# Altium schematic sheet Robot-Main.schdoc
size A2
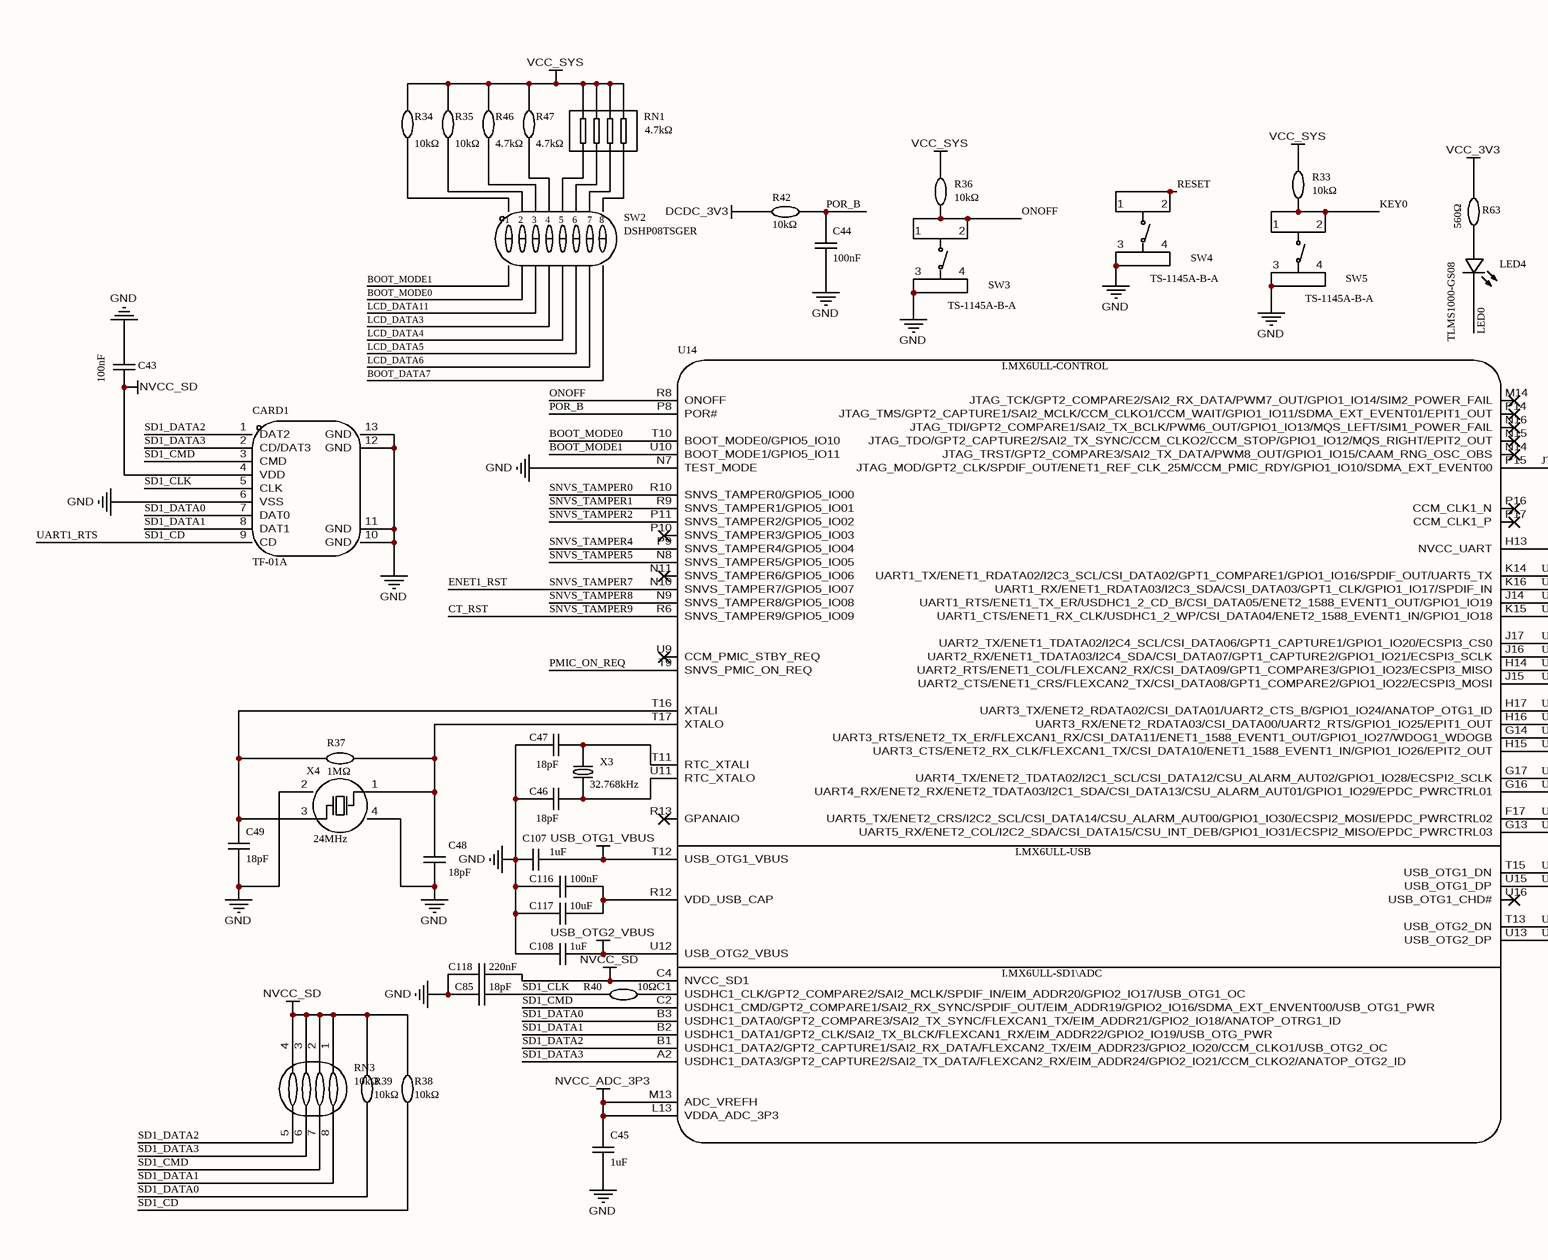
[diagram p0: Robot-Main.schdoc, left]
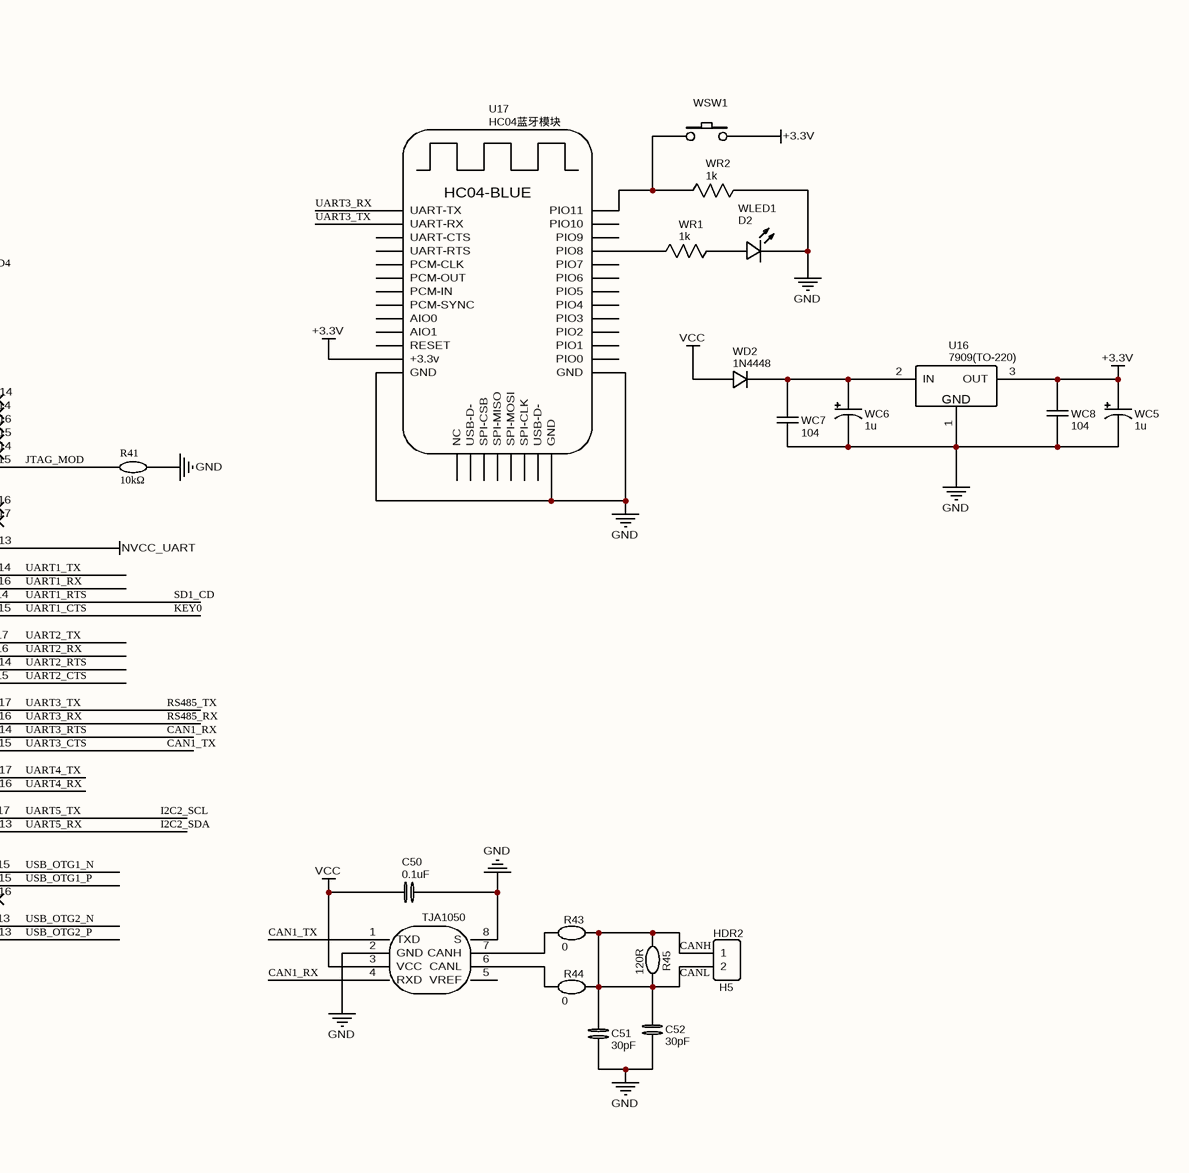
[diagram p1: Robot-Main.schdoc, right]

## Parts
C43  100nF  [0]  (value not drawn)
C44  100nF  [0]  (value not drawn)
C45  1uF  [0]  (value not drawn)
C46  18pF  [0]  (value not drawn)
C47  18pF  [0]  (value not drawn)
C48  18pF  [0]  (value not drawn)
C49  18pF  [0]  (value not drawn)
C50  0.1uF  [C0603]
C51  30pF  [C0603]
C52  30pF  [C0603]
C85  18pF  [0]  (value not drawn)
C107  1uF  [0]  (value not drawn)
C108  1uF  [0]  (value not drawn)
C116  100nF  [0]  (value not drawn)
C117  10uF  [0]  (value not drawn)
C118  220nF  [0]  (value not drawn)
CARD1  TF-01A  [0]  (value not drawn)
H5  HDR2  [HDR-F-2.54_1X2]
LED4  TLMS1000-GS08  [0]  (value not drawn)
R33  10kΩ  [0]  (value not drawn)
R34  10kΩ  [0]  (value not drawn)
R35  10kΩ  [0]  (value not drawn)
R36  10kΩ  [0]  (value not drawn)
R37  1MΩ  [0]  (value not drawn)
R38  10kΩ  [0]  (value not drawn)
R39  10kΩ  [0]  (value not drawn)
R40  10Ω  [0]  (value not drawn)
R41  10kΩ  [0]  (value not drawn)
R42  10kΩ  [0]  (value not drawn)
R43  0  [R0603]
R44  0  [R0603]
R45  120R  [R0603]
R46  4.7kΩ  [0]  (value not drawn)
R47  4.7kΩ  [0]  (value not drawn)
R63  560Ω  [0]  (value not drawn)
RN1  4.7kΩ  [0]  (value not drawn)
RN3  10kΩ  [0]  (value not drawn)
SW2  DSHP08TSGER  [0]  (value not drawn)
SW3  TS-1145A-B-A  [0]  (value not drawn)
SW4  TS-1145A-B-A  [0]  (value not drawn)
SW5  TS-1145A-B-A  [0]  (value not drawn)
U14  MCIMX6Y2CVM08AB  [0]  (value not drawn)
U15  TJA1050  [SOIC-8_L5.0-W4.0-P1.27-LS6.0-BL]
U16  7909(TO-220)  [TO-220IS_L10.16-W4.7-P2.54-L]
U17  HC04蓝牙模块
WC5  1u  [CAP-D3.0XF1.5]
WC6  1u  [CAP-D3.0XF1.5]
WC7  104  [RAD-0.1]
WC8  104  [RAD-0.1]
WD2  1N4448  [DO-35]
WLED1  D2  [LED-3MM/2.54]
WR1  1k  [AXIAL-0.3]
WR2  1k  [AXIAL-0.3]
WSW1  EVQ22705R  [KEY-6.0*6.0-4]  (value not drawn)
X3  32.768kHz  [0]  (value not drawn)
X4  24MHz  [0]  (value not drawn)

## Nets
+3.3V: U16.3(OUT) U17.15(+3.3v) WC5.1 WC8.2 WSW1.2
DCDC_3V3: R42.2
GND: C43.1 C44.2 C45.1 C46.2 C47.2 C48.1 C49.1 C50.2 C51.1 C52.1 C85.2 C107.2 C108.2 C116.1 C117.2 C118.2 CARD1.6(VSS) CARD1.10(GND) CARD1.11(GND) CARD1.12(GND) CARD1.13(GND) R41.1 SW3.3 SW3.4 SW4.3 SW4.4 SW5.3 SW5.4 U14.N7(TEST_MODE) U15.2(GND) U15.8(S) U16.1(GND) U17.14(GND) U17.28(GND) U17.36(GND) WC5.2 WC6.2 WC7.1 WC8.1 WLED1.2(K) WR2.2 X4.2(GND) X4.4(GND)
NVCC_ADC_3P3: C45.2 U14.L13(VDDA_ADC_3P3) U14.M13(ADC_VREFH)
NVCC_SD: C43.2 C118.1 CARD1.4(VDD) R38.2 R39.2 RN3.1 RN3.2 RN3.3 RN3.4 U14.C4(NVCC_SD1)
NVCC_UART: U14.H13(NVCC_UART)
USB_OTG1_VBUS: C107.1 U14.T12(USB_OTG1_VBUS)
USB_OTG2_VBUS: C108.1 U14.U12(USB_OTG2_VBUS)
VCC: C50.1 U15.3(VCC) WD2.1(A)
VCC_3V3: R63.1
VCC_SYS: R33.1 R34.2 R35.2 R36.1 R46.2 R47.2 RN1.1 RN1.2 RN1.3 RN1.4
BOOT_DATA7: SW2.16
BOOT_MODE0: SW2.10(PIN10) U14.T10(BOOT_MODE0/GPIO5_IO10)
BOOT_MODE1: SW2.9(PIN9) U14.U10(BOOT_MODE1/GPIO5_IO11)
CAN1_RX: U14.G14(UART3_RTS/ENET2_TX_ER/FLEXCAN1_RX/CSI_DATA11/ENET1_1588_EVENT1_OUT/GPIO1_IO27/WDOG1_WDOGB) U15.4(RXD)  [also labelled UART3_RTS]
CAN1_TX: U14.H15(UART3_CTS/ENET2_RX_CLK/FLEXCAN1_TX/CSI_DATA10/ENET1_1588_EVENT1_IN/GPIO1_IO26/EPIT2_OUT) U15.1(TXD)  [also labelled UART3_CTS]
CANH: C51.2 C52.2 H5.1 H5.2 R43.2 R44.2 R45.1 R45.2  [also labelled CANL]
CT_RST: U14.R6(SNVS_TAMPER9/GPIO5_IO09)  [also labelled SNVS_TAMPER9]
ENET1_RST: U14.N10(SNVS_TAMPER7/GPIO5_IO07)  [also labelled SNVS_TAMPER7]
I2C2_SCL: U14.F17(UART5_TX/ENET2_CRS/I2C2_SCL/CSI_DATA14/CSU_ALARM_AUT00/GPIO1_IO30/ECSPI2_MOSI/EPDC_PWRCTRL02)  [also labelled UART5_TX]
I2C2_SDA: U14.G13(UART5_RX/ENET2_COL/I2C2_SDA/CSI_DATA15/CSU_INT_DEB/GPIO1_IO31/ECSPI2_MISO/EPDC_PWRCTRL03)  [also labelled UART5_RX]
JTAG_MOD: R41.2 U14.P15(JTAG_MOD/GPT2_CLK/SPDIF_OUT/ENET1_REF_CLK_25M/CCM_PMIC_RDY/GPIO1_IO10/SDMA_EXT_EVENT00)
KEY0: R33.2 SW5.1 SW5.2 U14.K15(UART1_CTS/ENET1_RX_CLK/USDHC1_2_WP/CSI_DATA04/ENET2_1588_EVENT1_IN/GPIO1_IO18)  [also labelled UART1_CTS]
LCD_DATA3: SW2.12(PIN12)
LCD_DATA4: SW2.13(PIN13)
LCD_DATA5: SW2.14(PIN14)
LCD_DATA6: SW2.15
LCD_DATA11: SW2.11(PIN11)
LED0: LED4.2(K)
ONOFF: R36.2 SW3.1 SW3.2 U14.R8(ONOFF)
PMIC_ON_REQ: U14.T9(SNVS_PMIC_ON_REQ)
POR_B: C44.1 R42.1 U14.P8(POR#)
RESET: SW4.1 SW4.2
RS485_RX: U14.H16(UART3_RX/ENET2_RDATA03/CSI_DATA00/UART2_RTS/GPIO1_IO25/EPIT1_OUT) U17.27(UART-TX)  [also labelled UART3_RX]
RS485_TX: U14.H17(UART3_TX/ENET2_RDATA02/CSI_DATA01/UART2_CTS_B/GPIO1_IO24/ANATOP_OTG1_ID) U17.26(UART-RX)  [also labelled UART3_TX]
SD1_CD: CARD1.9(CD) R38.1 U14.J14(UART1_RTS/ENET1_TX_ER/USDHC1_2_CD_B/CSI_DATA05/ENET2_1588_EVENT1_OUT/GPIO1_IO19)  [also labelled UART1_RTS]
SD1_CLK: C85.1 CARD1.5(CLK) R40.1
SD1_CMD: CARD1.3(CMD) RN3.7 U14.C2(USDHC1_CMD/GPT2_COMPARE1/SAI2_RX_SYNC/SPDIF_OUT/EIM_ADDR19/GPIO2_IO16/SDMA_EXT_ENVENT00/USB_OTG1_PWR)
SD1_DATA0: CARD1.7(DAT0) R39.1 U14.B3(USDHC1_DATA0/GPT2_COMPARE3/SAI2_TX_SYNC/FLEXCAN1_TX/EIM_ADDR21/GPIO2_IO18/ANATOP_OTRG1_ID)
SD1_DATA1: CARD1.8(DAT1) RN3.8 U14.B2(USDHC1_DATA1/GPT2_CLK/SAI2_TX_BLCK/FLEXCAN1_RX/EIM_ADDR22/GPIO2_IO19/USB_OTG_PWR)
SD1_DATA2: CARD1.1(DAT2) RN3.5 U14.B1(USDHC1_DATA2/GPT2_CAPTURE1/SAI2_RX_DATA/FLEXCAN2_TX/EIM_ADDR23/GPIO2_IO20/CCM_CLKO1/USB_OTG2_OC)
SD1_DATA3: CARD1.2(CD/DAT3) RN3.6 U14.A2(USDHC1_DATA3/GPT2_CAPTURE2/SAI2_TX_DATA/FLEXCAN2_RX/EIM_ADDR24/GPIO2_IO21/CCM_CLKO2/ANATOP_OTG2_ID)
SNVS_TAMPER0: U14.R10(SNVS_TAMPER0/GPIO5_IO00)
SNVS_TAMPER1: U14.R9(SNVS_TAMPER1/GPIO5_IO01)
SNVS_TAMPER2: U14.P11(SNVS_TAMPER2/GPIO5_IO02)
SNVS_TAMPER4: U14.P9(SNVS_TAMPER4/GPIO5_IO04)
SNVS_TAMPER5: U14.N8(SNVS_TAMPER5/GPIO5_IO05)
SNVS_TAMPER8: U14.N9(SNVS_TAMPER8/GPIO5_IO08)
UART1_RX: U14.K16(UART1_RX/ENET1_RDATA03/I2C3_SDA/CSI_DATA03/GPT1_CLK/GPIO1_IO17/SPDIF_IN)
UART1_TX: U14.K14(UART1_TX/ENET1_RDATA02/I2C3_SCL/CSI_DATA02/GPT1_COMPARE1/GPIO1_IO16/SPDIF_OUT/UART5_TX)
UART2_CTS: U14.J15(UART2_CTS/ENET1_CRS/FLEXCAN2_TX/CSI_DATA08/GPT1_COMPARE2/GPIO1_IO22/ECSPI3_MOSI)
UART2_RTS: U14.H14(UART2_RTS/ENET1_COL/FLEXCAN2_RX/CSI_DATA09/GPT1_COMPARE3/GPIO1_IO23/ECSPI3_MISO)
UART2_RX: U14.J16(UART2_RX/ENET1_TDATA03/I2C4_SDA/CSI_DATA07/GPT1_CAPTURE2/GPIO1_IO21/ECSPI3_SCLK)
UART2_TX: U14.J17(UART2_TX/ENET1_TDATA02/I2C4_SCL/CSI_DATA06/GPT1_CAPTURE1/GPIO1_IO20/ECSPI3_CS0)
UART4_RX: U14.G16(UART4_RX/ENET2_RX/ENET2_TDATA03/I2C1_SDA/CSI_DATA13/CSU_ALARM_AUT01/GPIO1_IO29/EPDC_PWRCTRL01)
UART4_TX: U14.G17(UART4_TX/ENET2_TDATA02/I2C1_SCL/CSI_DATA12/CSU_ALARM_AUT02/GPIO1_IO28/ECSPI2_SCLK)
USB_OTG1_N: U14.T15(USB_OTG1_DN)
USB_OTG1_P: U14.U15(USB_OTG1_DP)
USB_OTG2_N: U14.T13(USB_OTG2_DN)
USB_OTG2_P: U14.U13(USB_OTG2_DP)
NetC46_1: C46.1 U14.U11(RTC_XTALO) X3.1
NetC47_1: C47.1 U14.T11(RTC_XTALI) X3.2
NetC48_2: C48.2 R37.2 U14.T17(XTALO) X4.1(OSC1)
NetC49_2: C49.2 R37.1 U14.T16(XTALI) X4.3(OSC2)
NetC116_2: C116.2 C117.1 U14.R12(VDD_USB_CAP)
NetLED4_1: LED4.1(A) R63.2
NetR34_1: R34.1 SW2.1(PIN1)
NetR35_1: R35.1 SW2.2(PIN2)
NetR40_2: R40.2 U14.C1(USDHC1_CLK/GPT2_COMPARE2/SAI2_MCLK/SPDIF_IN/EIM_ADDR20/GPIO2_IO17/USB_OTG1_OC)
NetR43_1: R43.1 U15.7(CANH)
NetR44_1: R44.1 U15.6(CANL)
NetR46_1: R46.1 SW2.3(PIN3)
NetR47_1: R47.1 SW2.4(PIN4)
NetRN1_5: RN1.5 SW2.5(PIN5)
NetRN1_6: RN1.6 SW2.6(PIN6)
NetRN1_7: RN1.7 SW2.7(PIN7)
NetRN1_8: RN1.8 SW2.8(PIN8)
NetU16_2: U16.2(IN) WC6.1 WC7.2 WD2.2(K)
NetU17_10: U17.10(PIO8) WR1.1
NetU17_13: U17.13(PIO11) WR2.1 WSW1.1
NetWLED1_1: WLED1.1(A) WR1.2

Not connected (* = marked no-connect by the designer): U14 M14(JTAG_TCK/GPT2_COMPARE2/SAI2_RX_DATA/PWM7_OUT/GPIO1_IO14/SIM2_POWER_FAIL)* N11(SNVS_TAMPER6/GPIO5_IO06)* N14(JTAG_TRST/GPT2_COMPARE3/SAI2_TX_DATA/PWM8_OUT/GPIO1_IO15/CAAM_RNG_OSC_OBS)* N15(JTAG_TDO/GPT2_CAPTURE2/SAI2_TX_SYNC/CCM_CLKO2/CCM_STOP/GPIO1_IO12/MQS_RIGHT/EPIT2_OUT)* N16(JTAG_TDI/GPT2_COMPARE1/SAI2_TX_BCLK/PWM6_OUT/GPIO1_IO13/MQS_LEFT/SIM1_POWER_FAIL)* P10(SNVS_TAMPER3/GPIO5_IO03)* P14(JTAG_TMS/GPT2_CAPTURE1/SAI2_MCLK/CCM_CLKO1/CCM_WAIT/GPIO1_IO11/SDMA_EXT_EVENT01/EPIT1_OUT)* P16(CCM_CLK1_N)* P17(CCM_CLK1_P)* R13(GPANAIO)* U9(CCM_PMIC_STBY_REQ)* U16(USB_OTG1_CHD#)*; U15 5(VREF); U17 2(PIO0) 3(PIO1) 4(PIO2) 5(PIO3) 6(PIO4) 7(PIO5) 8(PIO6) 9(PIO7) 11(PIO9) 12(PIO10) 16(RESET) 17(AIO0) 18(AIO1) 19(PCM-SYNC) 20(PCM-IN) 21(PCM-OUT) 22(PCM-CLK) 24(UART-RTS) 25(UART-CTS) 29(USB-D-) 30(SPI-CLK) 31(SPI-MOSI) 32(SPI-MISO) 33(SPI-CSB) 34(USB-D-) 35(NC)

## Notes on the sheet
- (in symbol HC04蓝牙模块) HC04-BLUE
- (in symbol MCIMX6Y2CVM08AB) I.MX6ULL-CONTROL; I.MX6ULL-USB; I.MX6ULL-SD1\ADC

## Library data of the parts
C43 C44 C116 = 100nF: Manufacturer: FH(风华); Symbol: 0402B104K160NT; Add into BOM: yes; Tolerance: ±10%; Voltage Rated: 16V; Temperature Coefficient: X7R; Name: 100nF; Device: 0402B104K160NT; LCSC Part Name: 100nF ±10% 16V; Supplier Part: C41851; Manufacturer Part: 0402B104K160NT; Supplier Footprint: 0402; JLCPCB Part Class: 扩展库; Datasheet: https://atta.szlcsc.com/upload/public/pdf/source/20170923/C41851_1506149456453988767.pdf; Supplier: LCSC; Convert to PCB: yes
C45 C107 C108 = 1uF: Manufacturer: SAMSUNG(三星); Symbol: CL05A105KP5NNNC; Add into BOM: yes; Tolerance: ±10%; Voltage Rated: 10V; Temperature Coefficient: X5R; Name: 1uF; Device: CL05A105KP5NNNC; LCSC Part Name: 1uF ±10% 10V; Supplier Part: C14445; Manufacturer Part: CL05A105KP5NNNC; Supplier Footprint: 0402; JLCPCB Part Class: 扩展库; Datasheet: https://atta.szlcsc.com/upload/public/pdf/source/20160103/1457707670698.pdf; Supplier: LCSC; Convert to PCB: yes
C46-C49 C85 = 18pF: Manufacturer: muRata(村田); Symbol: GRM1555C1H180JA01D; Add into BOM: yes; Tolerance: ±5%; Voltage Rated: 50V; Temperature Coefficient: C0G; Name: 18pF; Device: GRM1555C1H180JA01D; LCSC Part Name: 18pF ±5% 50V; Supplier Part: C33149; Manufacturer Part: GRM1555C1H180JA01D; Supplier Footprint: 0402; JLCPCB Part Class: 扩展库; Datasheet: https://atta.szlcsc.com/upload/public/pdf/source/20161108/1478586362936.pdf; Supplier: LCSC; Convert to PCB: yes
C50 = 0.1uF: nameAlias: Value(F); Contributor: LCEDA_Lib; spicePre: C; spiceSymbolName: C_0603_EU
C51 C52 = 30pF: nameAlias: Value(F); Contributor: LCEDA_Lib; spicePre: C; spiceSymbolName: C_0603_EU
C117 = 10uF: Manufacturer: TAIYO YUDEN(太诱); Symbol: JMK107BC6106MA-T; Add into BOM: yes; Tolerance: ±20%; Name: 10uF; Device: JMK107BC6106MA-T; LCSC Part Name: 10uF ±20%; Supplier Part: C669868; Manufacturer Part: JMK107BC6106MA-T; Supplier Footprint: 0603; JLCPCB Part Class: 扩展库; Datasheet: https://atta.szlcsc.com/upload/public/pdf/source/20200708/C669868_7EB6EA763537011BBD5B3495B56B624F.pdf; Supplier: LCSC; Convert to PCB: yes; Voltage Rated: -; Temperature Coefficient: -
C118 = 220nF: Manufacturer: SAMSUNG(三星); Symbol: CL05B224KO5NNNC; Add into BOM: yes; Tolerance: ±10%; Voltage Rated: 16V; Temperature Coefficient: X7R; Name: 220nF; Device: CL05B224KO5NNNC; LCSC Part Name: 220nF ±10% 16V; Supplier Part: C16772; Manufacturer Part: CL05B224KO5NNNC; Supplier Footprint: 0402; JLCPCB Part Class: 基础库; Datasheet: https://atta.szlcsc.com/upload/public/pdf/source/20160103/1457707689724.pdf; Supplier: LCSC; Convert to PCB: yes
CARD1 = TF-01A: Manufacturer: Yuandi(元迪); Symbol: TF-01A_C2889258; Add into BOM: yes; Card Type: MicroSD卡(TF卡); Connector Type: 卡座; Card Connection Mode: 自弹式; Maximum Body Height: 2mm; Name: TF-01A; Device: TF-01A_C2889258; LCSC Part Name: TF卡座自弹式9P外焊卡座; Supplier Part: C2889258; Manufacturer Part: TF-01A; Supplier Footprint: SMD; JLCPCB Part Class: 扩展库; Datasheet: https://atta.szlcsc.com/upload/public/pdf/source/20210830/44259D2B93BF4B637A446EF1520C4989.pdf; Supplier: LCSC; Convert to PCB: yes; Operating Temperature Range: -
H5 = HDR2: Contributor: LCEDA_Lib; Supplier Part: C49661; Supplier: LCSC; spicePre: H; spiceSymbolName: HDR-F-2.54_1x2
LED4 = TLMS1000-GS08: Manufacturer: VISHAY(威世); Add into BOM: yes; Emitted Color: 红灯; Name: TLMS1000-GS08; Symbol: TLMS1000-GS08; Device: TLMS1000-GS08; LCSC Part Name: 红灯; Supplier Part: C241893; Manufacturer Part: TLMS1000-GS08; Supplier Footprint: 0603; JLCPCB Part Class: 扩展库; Datasheet: https://atta.szlcsc.com/upload/public/pdf/source/20180719/C241893_4BC7C846B3C52AB2D39E337E84999DF0.pdf; Supplier: LCSC; Convert to PCB: yes
R33-R36 R38 R39 R41 R42 = 10kΩ: Manufacturer: YAGEO(国巨); Symbol: AC0402FR-0710KL; Add into BOM: yes; Tolerance: ±1%; Power(Watts): 62.5mW; Temperature Coefficient: ±100ppm/; Overload Voltage (Max): 50V; Name: 10kΩ; Device: AC0402FR-0710KL; LCSC Part Name: 10kΩ ±1% 62.5mW; Supplier Part: C144807; Manufacturer Part: AC0402FR-0710KL; Supplier Footprint: 0402; JLCPCB Part Class: 扩展库; Datasheet: https://atta.szlcsc.com/upload/public/pdf/source/20171225/C144807_15141880815031202999.pdf; Supplier: LCSC; Convert to PCB: yes; Type: 厚膜电阻; Operating Temperature Range: -55+155
R37 = 1MΩ: Manufacturer: RESI(开步睿思）; Symbol: AECR0402F1M00K9; Add into BOM: yes; Tolerance: ±1%; Power(Watts): 63mW; Temperature Coefficient: ±100ppm/℃; Overload Voltage (Max): 50V; Name: 1MΩ; Device: AECR0402F1M00K9; LCSC Part Name: 1MΩ ±1% 63mW; Supplier Part: C328306; Manufacturer Part: AECR0402F1M00K9; Supplier Footprint: 0402; JLCPCB Part Class: 扩展库; Datasheet: https://atta.szlcsc.com/upload/public/pdf/source/20181108/C328306_B95BAB61EFEEF68A94132A20FE3D4C1C.pdf; Supplier: LCSC; Convert to PCB: yes; Type: 厚膜电阻; Operating Temperature Range: -55℃+125℃
R40 = 10Ω: Manufacturer: YAGEO(国巨); Symbol: RC0402FR-0710RL; Add into BOM: yes; Tolerance: ±1%; Power(Watts): 62.5mW; Temperature Coefficient: ±200ppm/℃; Overload Voltage (Max): 50V; Name: 10Ω; Device: RC0402FR-0710RL; LCSC Part Name: 10Ω ±1% 62.5mW; Supplier Part: C138066; Manufacturer Part: RC0402FR-0710RL; Supplier Footprint: 0402; JLCPCB Part Class: 扩展库; Datasheet: https://atta.szlcsc.com/upload/public/pdf/source/20171107/C138066_15100516786461096988.pdf; Supplier: LCSC; Convert to PCB: yes; Operating Temperature Range: -55℃+155℃
R43 R44 = 0: nameAlias: Value(Ω); Contributor: LCEDA_Lib; spicePre: R; spiceSymbolName: R_0603_EU
R45 = 120R: nameAlias: Value(Ω); Contributor: LCEDA_Lib; spicePre: R; spiceSymbolName: R_0603_EU
R46 R47 = 4.7kΩ: Manufacturer: UNI-ROYAL(厚声); Symbol: 0402WGF4701TCE; Add into BOM: yes; Power(Watts): 1/16W; Tolerance: ±1%; Temperature Coefficient: ±100ppm/℃; Overload Voltage (Max): 50V; Name: 4.7kΩ; Device: 0402WGF4701TCE; LCSC Part Name: 4.7KΩ ±1%; Supplier Part: C25900; Manufacturer Part: 0402WGF4701TCE; Supplier Footprint: 0402; JLCPCB Part Class: 基础库; Datasheet: https://atta.szlcsc.com/upload/public/pdf/source/20170920/C25900_1505895105102980906.pdf; Supplier: LCSC; Convert to PCB: yes; Operating Temperature Range: -55℃+155℃
R63 = 560Ω: Manufacturer: PANASONIC(松下); Symbol: ERJ2RKF5600X; Add into BOM: yes; Tolerance: ±1%; Power(Watts): 100mW; Temperature Coefficient: ±100ppm/℃; Name: 560Ω; Device: ERJ2RKF5600X; LCSC Part Name: 560Ω ±1% 100mW; Supplier Part: C278600; Manufacturer Part: ERJ2RKF5600X; Supplier Footprint: 0402; JLCPCB Part Class: 扩展库; Datasheet: https://atta.szlcsc.com/upload/public/pdf/source/20181130/C278600_A445C90BAA350EC51F156105354E4432.pdf; Supplier: LCSC; Convert to PCB: yes; Type: 厚膜电阻; Overload Voltage (Max): -; Operating Temperature Range: -55℃+155℃
RN1 = 4.7kΩ: Manufacturer: RALEC(旺诠); Symbol: RTA02-4D472JTH; Add into BOM: yes; Power(Watts): 62.5mW; Number of Resistors: 4; Name: 4.7kΩ; Device: RTA02-4D472JTH; LCSC Part Name: 4.7kΩ ±5%; Supplier Part: C102638; Manufacturer Part: RTA02-4D472JTH; Supplier Footprint: SMD,2x1mm; JLCPCB Part Class: 扩展库; Datasheet: https://atta.szlcsc.com/upload/public/pdf/source/20170408/1491642547157.pdf; Supplier: LCSC; Convert to PCB: yes; Number of Pins: 8
RN3 = 10kΩ: Manufacturer: YAGEO(国巨); Symbol: YC124-JR-0710KL; Add into BOM: yes; Power(Watts): 62.5mW; Number of Resistors: 4; Name: 10kΩ; Device: YC124-JR-0710KL; LCSC Part Name: 10kΩ ±5%; Supplier Part: C326872; Manufacturer Part: YC124-JR-0710KL; Supplier Footprint: 0804; JLCPCB Part Class: 扩展库; Datasheet: https://atta.szlcsc.com/upload/public/pdf/source/20181031/C326872_7ADCADFB181E82D26DE5D98DCBAEF4F5.pdf; Supplier: LCSC; Convert to PCB: yes; Number of Pins: 8
SW2 = DSHP08TSGER: Manufacturer: 康深; Symbol: DSHP08TSGER_C3293147; Add into BOM: yes; Name: DSHP08TSGER; Device: DSHP08TSGER; LCSC Part Name: 8位 1.27mm脚距; Supplier Part: C3293147; Manufacturer Part: DSHP08TSGER; Supplier Footprint: SMD-16P,11.74x5.4mm; JLCPCB Part Class: 扩展库; Datasheet: https://atta.szlcsc.com/upload/public/pdf/source/20220713/22525EA437E8BDBA6DC20D0B6C422A83.pdf; Supplier: LCSC; Convert to PCB: yes
SW3-SW5 = TS-1145A-B-A: Manufacturer: XKB Connectivity(中国星坤); Add into BOM: yes; Contact Current: 50mA; Voltage Rating (DC): 12V; Circuit: 单刀单掷; Actuator Style: 椭圆形按钮; Actuator/Cap Color: 白色; With Lamp: 无; Operating Force: 160gf; Mechanical Life: 100000; Switch Length: 4.2mm; Switch Width: 3.2mm; Switch Height: 2.5mm; Strike Gundam: 否; Name: TS-1145A-B-A; Symbol: TS-1145A-B-A; Device: TS-1145A-B-A; LCSC Part Name: 3.2X4.2X2.5平脚160gf白色按钮; Supplier Part: C318904; Manufacturer Part: TS-1145A-B-A; Supplier Footprint: SMD; JLCPCB Part Class: 扩展库; Datasheet: https://atta.szlcsc.com/upload/public/pdf/source/20211011/FC00869C3CE33BCCD344D072F551E76B.pdf; Supplier: LCSC; Convert to PCB: yes; Insulation Resistance: -; Mounting Style: 立贴; Operating Temperature: -30℃+85℃
U14 = MCIMX6Y2CVM08AB: Manufacturer: NXP(恩智浦); Manufacturer Part: MCIMX6Y2CVM05AB; Add into BOM: yes; Symbol: MCIMX6Y2CVM08AB; Device: MCIMX6Y2CVM08AB; LCSC Part Name: MCIMX6Y2CVM05AB; Supplier Part: C394783; Supplier Footprint: MAPBGA_14x14mm; JLCPCB Part Class: 扩展库; Datasheet: https://atta.szlcsc.com/upload/public/pdf/source/20190710/C394783_FD0F604CFEEF7C8D89A6504C0AF41ACD.pdf; Supplier: LCSC; Convert to PCB: yes; Core Size: -; Program Memory Type: -; Core Processor: -; Speed: -; Voltage - Supply (Vcc/Vdd): -; Program Memory Size: -; RAM Size: -; EEPROM Size: -; Number of I/O: -; A/D: -; D/A: -; PWM: -; LCD: -; UART/USART: -; SPI: -; I2C（SMBUS/PMBUS）: -; USB Device: -; USB Host/OTG: -; CAN: -; Ethernet: -; Features: -
U15 = TJA1050: Manufacturer: NXP; Manufacturer Part: TJA1050T/CM,118; Package Display: No; Supplier: LCSC; Supplier Part: C6952; JLCPCB Part Class: Basic Part; spicePre: U; spiceSymbolName: TJA1050T/CM,118
U16 = 7909(TO-220): Manufacturer: KEC Semicon; Manufacturer Part: KIA7909PI-U/PF; Contributor: LCEDA_Lib; Supplier: LCSC; Supplier Part: C220503; spicePre: U; spiceSymbolName: 7909(TO-220)
U17 = HC04蓝牙模块: Contributor: wls20010228; spicePre: U; spiceSymbolName: HC04蓝牙模块
WC5 WC6 = 1u: nameAlias: Value(F); spicePre: C; spiceSymbolName: Cap_Electrolytic(TH)_D3.0XF1.5_US
WC7 WC8 = 104: nameAlias: Value(F); spicePre: C; spiceSymbolName: Cap_RAD-0.1_US
WD2 = 1N4448: Manufacturer: SEMTECH; Supplier: LCSC; Manufacturer Part: 1N4448; image: //image.lceda.cn/szlcsc/C54037.jpg; Supplier Part: C54037; spicePre: D; spiceSymbolName: 1N4448
WLED1 = D2: Manufacturer: EVERLIGHT; Manufacturer Part: 204-10SURD/S530-A3; Supplier: LCSC; Supplier Part: C99772; spicePre: L; spiceSymbolName: 204-10SURD/S530-A3
WR1 WR2 = 1k: nameAlias: Value(Ω); spicePre: R; spiceSymbolName: Res_AXIAL-0.3(1/8W)_US
WSW1 = EVQ22705R: Manufacturer: PANASONIC; Contributor: LCSC; Supplier: LCSC; Manufacturer Part: EVQ22705R; Supplier Part: C79156; spicePre: S
X3 = 32.768kHz: Manufacturer: EPSON(爱普生); Symbol: Q13FC1350000400; Add into BOM: yes; Crystal Type: 贴片无源晶振; Frequency Tolerance: ±20ppm; Load Capacitance: 12.5pF; Equivalent Series Resistance (ESR): 70kΩ; Name: 32.768kHz; Device: Q13FC1350000400; LCSC Part Name: 32.768kHz ±20ppm 12.5pF; Supplier Part: C32346; Manufacturer Part: Q13FC1350000400; Supplier Footprint: SMD3215-2P; JLCPCB Part Class: 基础库; Datasheet: https://atta.szlcsc.com/upload/public/pdf/source/20190108/C32346_746D6B07EAF90824457A96480007685F.pdf; Supplier: LCSC; Convert to PCB: yes; Operating Temperature: -40℃+85℃
X4 = 24MHz: Manufacturer: EPSON(爱普生); Symbol: X1E0000210128; Add into BOM: yes; Crystal Type: 贴片无源晶振; Frequency Tolerance: ±10ppm; Load Capacitance: 10pF; Equivalent Series Resistance (ESR): 40Ω; Name: 24MHz; Device: X1E0000210128; LCSC Part Name: 24MHz ±10ppm 10pF; Supplier Part: C255916; Manufacturer Part: X1E0000210128; Supplier Footprint: SMD3225-4P; JLCPCB Part Class: 扩展库; Datasheet: https://atta.szlcsc.com/upload/public/pdf/source/20180822/C255916_D8096AE80498C545ACF8455F266541CE.pdf; Supplier: LCSC; Convert to PCB: yes; Operating Temperature: -40℃+85℃